# Altium schematic sheet user_interface.SchDoc
size A4; SheetNumber: 18; SheetTotal: 21
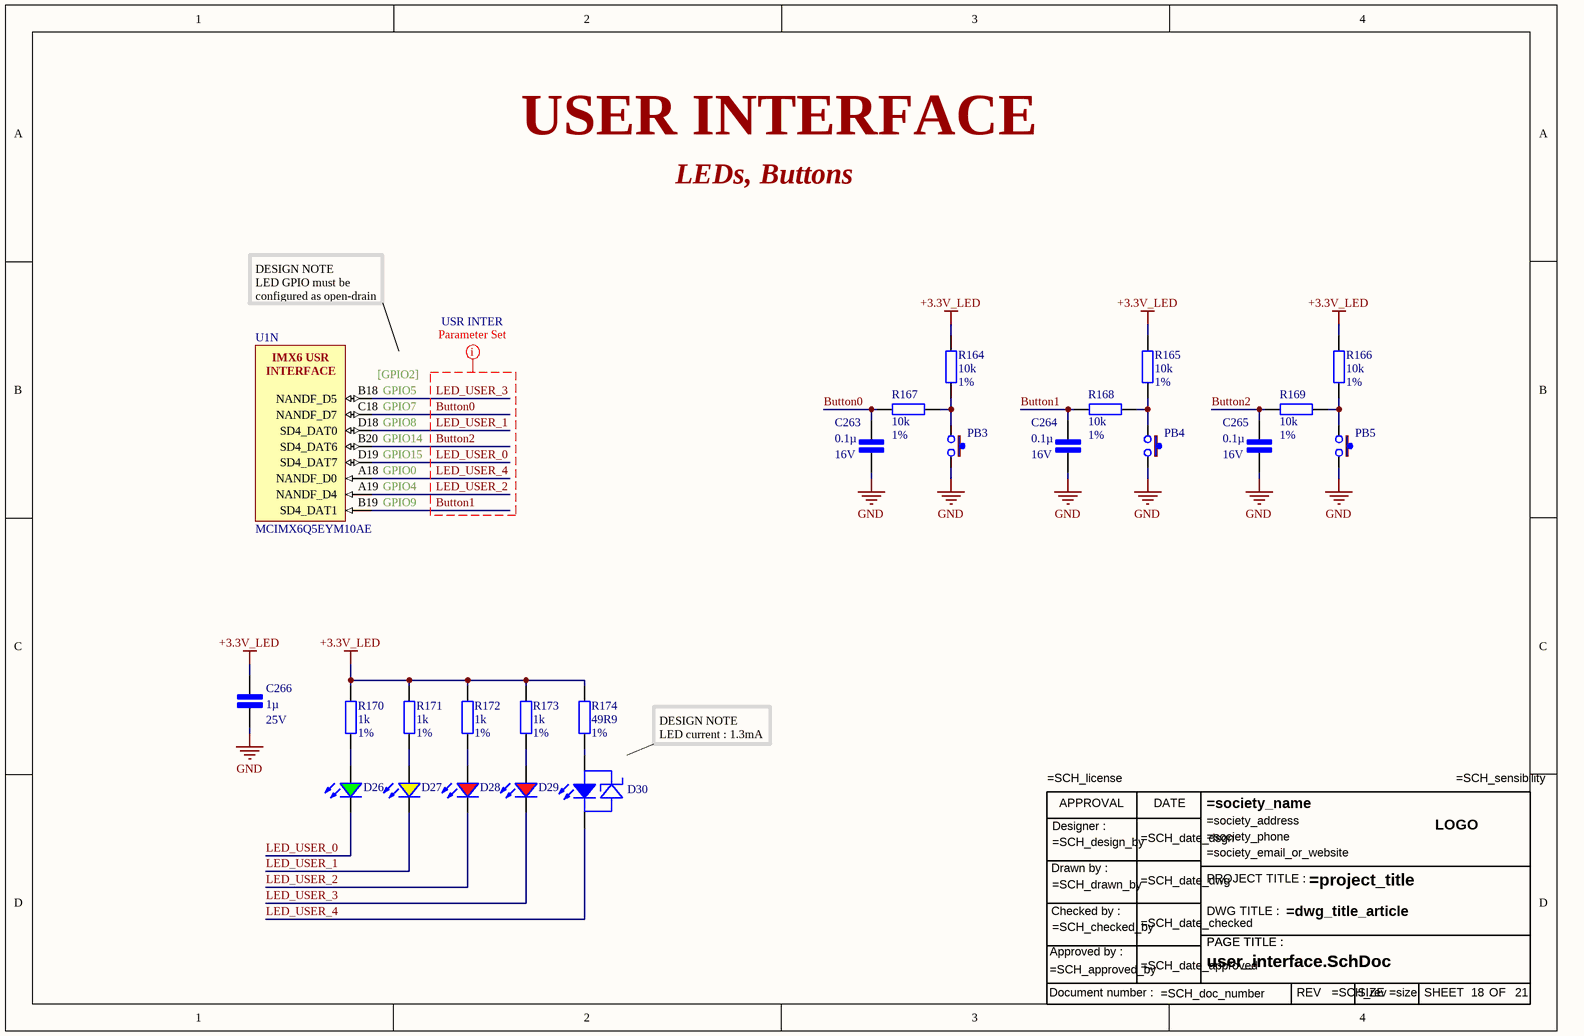
[diagram p0: user_interface.SchDoc]

## Parts
C263  0.1µ  Tension du diélectrique: 16V  [Cap cer 0402/1005]
C264  0.1µ  Tension du diélectrique: 16V  [Cap cer 0402/1005]
C265  0.1µ  Tension du diélectrique: 16V  [Cap cer 0402/1005]
C266  1µ  Tension du diélectrique: 25V  [Cap cer 0402/1005]
D26  Bright Green, 2V, 120deg  [LED green 0603]  (value not drawn)
D27  Yellow, 2V, 120deg  [LED yellow 0603]  (value not drawn)
D28  Red, 2V, 120deg  [LED red 0603]  (value not drawn)
D29  Red, 2V, 120deg  [LED red 0603]  (value not drawn)
D30  Blue, 3.2V, 120deg  [LED blue 0603]  (value not drawn)
PB3  pb_434121025816  [pb_434121025816]  (value not drawn)
PB4  pb_434121025816  [pb_434121025816]  (value not drawn)
PB5  pb_434121025816  [pb_434121025816]  (value not drawn)
R164  10k  pourcentage: 1%  [Res 0402/1005]
R165  10k  pourcentage: 1%  [Res 0402/1005]
R166  10k  pourcentage: 1%  [Res 0402/1005]
R167  10k  pourcentage: 1%  [Res 0402/1005]
R168  10k  pourcentage: 1%  [Res 0402/1005]
R169  10k  pourcentage: 1%  [Res 0402/1005]
R170  1k  pourcentage: 1%  [Res 0402/1005]
R171  1k  pourcentage: 1%  [Res 0402/1005]
R172  1k  pourcentage: 1%  [Res 0402/1005]
R173  1k  pourcentage: 1%  [Res 0402/1005]
R174  49R9  pourcentage: 1%  [Res 0402/1005]
TB17  Title bloc ANSI modified  (value not drawn)
U1  MCIMX6Q5EYM10AE  [FRES-2197-01]  (part N of 21)

## Nets
+3.3V_LED: C266.1 R164.2 R165.2 R166.2 R170.2 R171.2 R172.2 R173.2 R174.2
GND: C263.2 C264.2 C265.2 C266.2 PB3.2 PB4.2 PB5.2
Button0: C263.1 R167.2 U1.C18(NANDF_D7)
Button1: C264.1 R168.2 U1.B19(SD4_DAT1)
Button2: C265.1 R169.2 U1.B20(SD4_DAT6)
LED_USER_0: D26.1(K) U1.D19(SD4_DAT7)
LED_USER_1: D27.1(K) U1.D18(SD4_DAT0)
LED_USER_2: D28.1(K) U1.A19(NANDF_D4)
LED_USER_3: D29.1(K) U1.B18(NANDF_D5)
LED_USER_4: D30.1(K) U1.A18(NANDF_D0)
NetD26_2: D26.2(A) R170.1
NetD27_2: D27.2(A) R171.1
NetD28_2: D28.2(A) R172.1
NetD29_2: D29.2(A) R173.1
NetD30_2: D30.2(A) R174.1
NetPB3_1: PB3.1 R164.1 R167.1
NetPB4_1: PB4.1 R165.1 R168.1
NetPB5_1: PB5.1 R166.1 R169.1

## Layout directives
net class USR INTER: Button0, Button1, Button2, LED_USER_0, LED_USER_1, LED_USER_2, LED_USER_3, LED_USER_4

## Notes on the sheet
- USER INTERFACE
- LEDs, Buttons
- DESIGN NOTE
  LED GPIO must be configured as open-drain
- (near U1) [GPIO2]
- (near U1) GPIO5
- (near U1) GPIO7
- (near U1) GPIO8
- (near U1) GPIO14
- (near U1) GPIO15
- (near U1) GPIO0
- (near U1) GPIO4
- (near U1) GPIO9
- DESIGN NOTE
  LED current : 1.3mA
- (in symbol IMX6Q5EYM10AE, part N) IMX6 USR INTERFACE
- (in symbol Title bloc ANSI) APPROVAL; DATE; Designer :; LOGO; Drawn by :; PROJECT TITLE :; Checked by :; DWG TITLE :; PAGE TITLE :; Approved by :; Document number :; REV; SIZE; SHEET; OF

## Library data of the parts
C263-C265 = cap 0.1µ 16V: cap solid electrolyte 0.1µ 6.3V 10%; Diélectrique: X7R
C266 = cap 1µ 25V: cap cer 1µ 25V 10% X5R 0402; Diélectrique: X5R
D26 = LED green 0603: WL-SMCC SMD Mono-color Chip LED Compact, size 0603, Bright Green, 2V, 120deg 150060VS73220; Dominant Wavelength: 573nm; Luminous Intensity: 60mcd; Peak Wavelength: 575nm; Chip Technology: AlInGaP; ComponentLink1URL: http://www.we-online.de; ComponentLink2Description: Datasheet; ComponentLink2URL: https://katalog.we-online.com/led/datasheet/150060VS73220.pdf; Part Number: 150060VS73220; Published Date: July 2019; Publisher: Wurth Elektronik; Size: 0603; Viewing Angle: 120deg; Packaging: Tape and Reel; Emitting Color: Bright Green; Mounting Technology: SMT; Forward Voltage: 2V; Operating Temperature: -40 to +85degC
D27 = LED Yellow 0603: WL-SMCC SMD Mono-color Chip LED Compact, size 0603, Yellow, 2V, 120deg 150060YS73220; Dominant Wavelength: 589nm; Luminous Intensity: 100mcd; Peak Wavelength: 591nm; Chip Technology: AlInGaP; ComponentLink1URL: http://www.we-online.de; ComponentLink2Description: Datasheet; ComponentLink2URL: https://katalog.we-online.com/led/datasheet/150060YS73220.pdf; Part Number: 150060YS73220; Published Date: July 2019; Publisher: Wurth Elektronik; Size: 0603; Viewing Angle: 120deg; Packaging: Tape and Reel; Emitting Color: Yellow; Mounting Technology: SMT; Forward Voltage: 2V; Operating Temperature: -40 to +85degC
D28 D29 = LED Red 0603: WL-SMCC SMD Mono-color Chip LED Compact, size 0603, Red, 2V, 120deg 150060RS73220; Dominant Wavelength: 624nm; Luminous Intensity: 90mcd; Peak Wavelength: 632nm; Chip Technology: AlInGaP; ComponentLink1URL: http://www.we-online.de; ComponentLink2Description: Datasheet; ComponentLink2URL: https://katalog.we-online.com/led/datasheet/150060RS73220.pdf; Part Number: 150060RS73220; Published Date: July 2019; Publisher: Wurth Elektronik; Size: 0603; Viewing Angle: 120deg; Packaging: Tape and Reel; Emitting Color: Red; Mounting Technology: SMT; Forward Voltage: 2V; Operating Temperature: -40 to +85degC
D30 = LED blue 0603: WL-SMCC SMD Mono-color Chip LED Compact, size 0603, Blue, 3.2V, 120deg 150060BS73220; Dominant Wavelength: 470nm; Luminous Intensity: 170mcd; Peak Wavelength: 465nm; Chip Technology: InGaN; ComponentLink1URL: http://www.we-online.de; ComponentLink2Description: Datasheet; ComponentLink2URL: https://katalog.we-online.com/led/datasheet/150060BS73220.pdf; Part Number: 150060BS73220; Published Date: July 2019; Publisher: Wurth Elektronik; Size: 0603; Viewing Angle: 120deg; Packaging: Tape and Reel; Emitting Color: Blue; Mounting Technology: SMT; Forward Voltage: 3.2V; Operating Temperature: -40 to +85degC
R164-R169 = res 10k 1%: res 10k 1% 0402
R170-R173 = res 1k 1%: res 1k 1% 0402
R174 = res 49R9 1%: res 49R9 ohm 1% 0402
TB17 = Title bloc ANSI
U1 = IMX6Q5EYM10AE: 32-Bit i.MX 6 Quad Application Processor, 1 GHz, 256 KB RAM, Extended Consumer Grade, 624-Pin FCPBGA, RoHS, Tape and Reel; PartNumber: MCIMX6Q5EYM10ACR; Manufacturer: Freescale Semiconductor; CAN: FlexCAN; Number of Cores: 4 Spec; External Memory Supported: DDR3, DDR3L, FLASH, LPDDR2; Speed Grade: 1 GHz; Core Type: ARM Cortex A9; Cache (KB): 32; Ethernet: 1 Gbps + IEEE 1588; Internal RAM (KB): 256; ComponentLink1Description: Manufacturer URL; ComponentLink2Description: Datasheet; DatasheetVersion: Rev. 2.3; ComponentLink3URL: http://cache.freescale.com/files/32bit/doc/data_sheet/IMX6DQCEC.pdf?fpsp=1&WT_TYPE=Data%20Sheets&WT_VENDOR=FREESCALE&WT_FILE_FORMAT=pdf&WT_ASSET=Documentation; ComponentLink1URL: http://www.freescale.com/; Packing: Tape and Reel; Temperature Range: -20 to 105 degC; ComponentLink2URL: http://cache.freescale.com/files/32bit/doc/data_sheet/IMX6DQCEC.pdf?fpsp=1&WT_TYPE=Data%20Sheets&WT_VENDOR=FREESCALE&WT_FILE_FORMAT=pdf&WT_ASSET=Documentation; ComponentLink3Description: Package Specification; PackageVersion: Rev. A; RoHS: TRUE; Quad/Dual CPU: i.MX 6Quad; Mounting Technology: Surface Mount; PackageReference: FCPBGA-624; PackageDescription: 624-pin Ball Grid Array Package, Body 21 x 21mm, Pitch 0.8mm